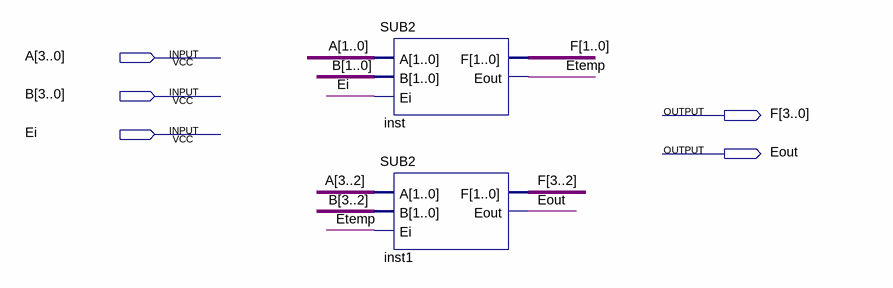
[diagram p0: schematic sheet]
// Quartus schematic SUB4.bdf as structural Verilog: 2 symbols, 5 pins
module SUB4 (
  input  [3:0] A,
  input  [3:0] B,
  input  Ei,
  output [3:0] F,
  output Eout
);

  wire Etemp;

  SUB2 inst (.A(A[1:0]), .B(B[1:0]), .Ei(Ei), .F(F[1:0]), .Eout(Etemp));
  SUB2 inst1 (.A(A[3:2]), .B(B[3:2]), .Ei(Etemp), .F(F[3:2]), .Eout(Eout));
endmodule
